# Altium project Ultrafit Breakout.PrjPcb
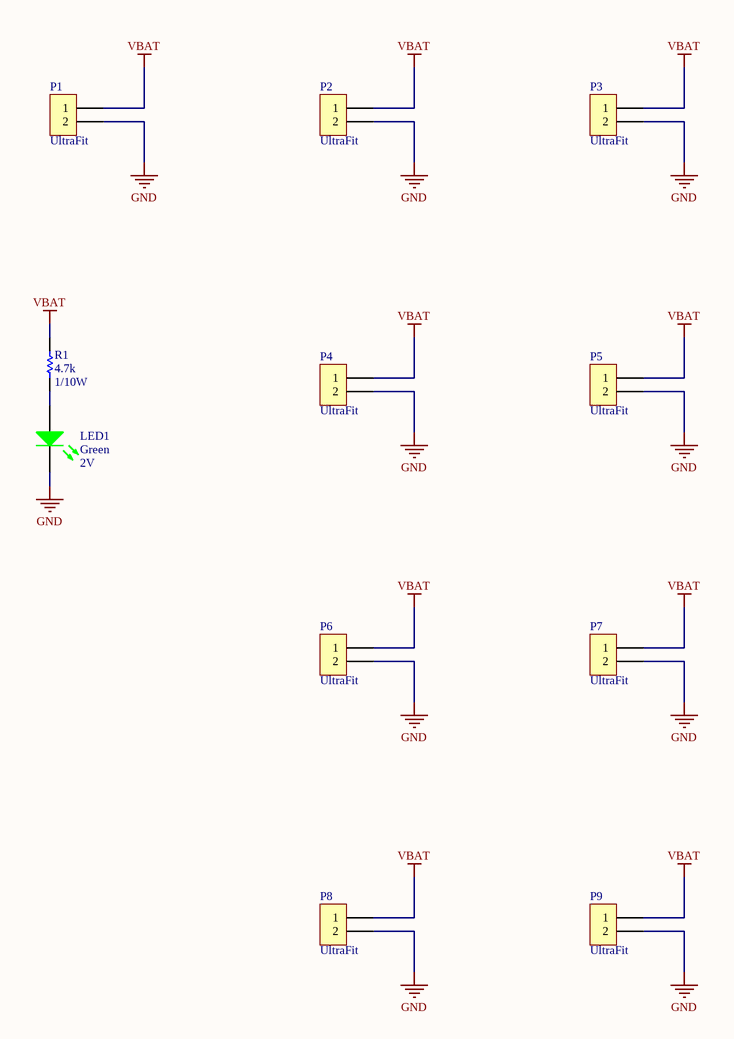
[diagram p0: Ultrafit Breakout.SchDoc]

1 sheet, 11 parts. Net scope: global (net labels, ports and power ports of the same name join across sheets).
Board file: Ultrafit Breakout.PcbDoc

## Sheet Ultrafit Breakout.SchDoc: Title
size B; Organization: Midnight Sun Solar Rayce Car Team; Address1: University of Waterloo; Address2: 200 University Ave W; Address3: Waterloo, ON, Canada; Address4: N2L 3E9; Website: www.uwmidsun.com; ProjectName: ProjectName

### Parts
LED1  Color: Green  Voltage - Forward (Vf) (Typ): 2V  [LED_0603]  (hidden comment: LED GREEN CLEAR 2V 0603)
P1  Series: UltraFit  [CONN, 2POS ULTRA-FIT]  (hidden comment: CONN 2POS ULTRA-FIT 0.138")
P2  Series: UltraFit  [CONN, 2POS ULTRA-FIT]  (hidden comment: CONN 2POS ULTRA-FIT 0.138")
P3  Series: UltraFit  [CONN, 2POS ULTRA-FIT]  (hidden comment: CONN 2POS ULTRA-FIT 0.138")
P4  Series: UltraFit  [CONN, 2POS ULTRA-FIT]  (hidden comment: CONN 2POS ULTRA-FIT 0.138")
P5  Series: UltraFit  [CONN, 2POS ULTRA-FIT]  (hidden comment: CONN 2POS ULTRA-FIT 0.138")
P6  Series: UltraFit  [CONN, 2POS ULTRA-FIT]  (hidden comment: CONN 2POS ULTRA-FIT 0.138")
P7  Series: UltraFit  [CONN, 2POS ULTRA-FIT]  (hidden comment: CONN 2POS ULTRA-FIT 0.138")
P8  Series: UltraFit  [CONN, 2POS ULTRA-FIT]  (hidden comment: CONN 2POS ULTRA-FIT 0.138")
P9  Series: UltraFit  [CONN, 2POS ULTRA-FIT]  (hidden comment: CONN 2POS ULTRA-FIT 0.138")
R1  Resistance (Ohms): 4.7k  Power (Watts): 1/10W  [RES, 0603]  (hidden comment: RES 4.7K OHM 1% 1/10W 0603)

### Nets
GND: LED1.2(K) P1.2 P2.2 P3.2 P4.2 P5.2 P6.2 P7.2 P8.2 P9.2
VBAT: P1.1 P2.1 P3.1 P4.1 P5.1 P6.1 P7.1 P8.1 P9.1 R1.1
NetLED1_1: LED1.1(A) R1.2

### Notes on the sheet
- PROJECT
- DOCUMENT
- DRAWN BY
- LAST MODIFIED
- PART NUMBER
- REVISION
- SHEET
- VARIANT
- OF
- Engineering 5 - 1002
  University of Waterloo
  (519) 888-4567 x32978
  hardware@uwmidsun.com

### Library data of the parts
LED1 = LED GREEN CLEAR 2V 0603: Green 572nm LED Indication - Discrete 2V 0603 (1608 Metric); Manufacturer: Wurth Electronics Inc.; Manufacturer Part Number: 150060VS75000; Lens Color: Colorless; Millicandela Rating: 40mcd; Lens Style/Size: Rectangle with Flat Top, 1.10mm x 0.70mm; Current - Test: 20mA; Viewing Angle: 140°; Wavelength - Dominant: 570nm; Supplier 1: Digi-Key; RoHS: RoHS Compliant; Category: Optoelectronics; Stock 1: 9408; Pricing 1: 1=0.21, 100=0.1617, 500=0.13964 (CAD); Packaging: Cut Tape (CT); Part Status: Active; Lens Transparency: Clear; Mounting Type: Surface Mount; Wavelength - Peak: 572nm; Features: -; Package / Case: 0603 (1608 Metric); Supplier Device Package: 0603; Size / Dimension: 1.60mm L x 0.80mm W; Height (Max): 0.80mm; ComponentLink1URL: http://katalog.we-online.de/led/datasheet/150060VS75000.pdf; ComponentLink1Description: http://katalog.we-online.de/led/datasheet/150060VS75000.pdf; Supplier Part Number 1: 732-4980-1-ND
P1-P9 = CONN 2POS ULTRA-FIT 0.138": 2 Positions Header, Shrouded Connector 0.138" (3.50mm) Through Hole Gold; Manufacturer 1: Molex, LLC; Manufacturer Part Number 1: 1722861302; Style: Board to Board or Cable; Shrouding: Shrouded - 4 Wall; Number of Positions: 2; Number of Positions Loaded: All; Contact Length - Post: 0.126" (3.20mm); Material Flammability Rating: UL94 V-0; Mated Stacking Heights: 26.99mm; Voltage: 400V; Supplier 1: Digi-Key; Supplier Part Number 1: WM11673-ND; Packaging: Tray; Part Status: Active; Connector Type: Header; Contact Type: Male Pin; Pitch - Mating: 0.138" (3.50mm); Number of Rows: 1; Row Spacing - Mating: -; Mounting Type: Through Hole; Termination: Kinked Pin, Solder; Fastening Type: Latch Holder; Contact Length - Mating: -; Overall Contact Length: -; Insulation Height: 0.465" (11.80mm); Contact Shape: Square; Contact Finish - Mating: Gold; Contact Finish Thickness - Mating: 30µin (0.76µm); Contact Finish - Post: Tin; Contact Material: Copper Alloy; Insulation Material: Liquid Crystal Polymer (LCP); Operating Temperature: -40°C ~ 120°C; Ingress Protection: -; Insulation Color: Black; Current Rating: -; Contact Finish Thickness - Post: 60µin (1.52µm); ComponentLink1URL: http://www.molex.com/pdm_docs/sd/1722861302_sd.pdf; ComponentLink1Description: http://www.molex.com/pdm_docs/sd/1722861302_sd.pdf
R1 = RES 4.7K OHM 1% 1/10W 0603: 4.7k Ohm ±1% 0.1W, 1/10W Chip Resistor 0603 (1608 Metric) Moisture Resistant Thick Film; Manufacturer 1: Yageo; Manufacturer Part Number 1: RC0603FR-074K7L; Description 1: RES SMD 4.7K OHM 1% 1/10W 0603; Temperature Coefficient: ±100ppm/°C; Supplier 1: Digi-Key; Supplier Part Number 1: 311-4.70KHRCT-ND; RoHS: RoHS Compliant; Category: Resistors; Stock 1: 3487566; Pricing 1: 1=0.16, 10=0.022, 100=0.0089, 1000=0.00402, 2500=0.00349 (CAD); Packaging: Cut Tape (CT); Part Status: Active; Composition: Thick Film; Features: Moisture Resistant; Operating Temperature: -55°C ~ 155°C; Package / Case: 0603 (1608 Metric); Supplier Device Package: 0603; Size / Dimension: 0.063" L x 0.031" W (1.60mm x 0.80mm); Height - Seated (Max): 0.022" (0.55mm); Failure Rate: -; ComponentLink1URL: http://www.yageo.com/documents/recent/PYu-RC_Group_51_RoHS_L_7.pdf; ComponentLink1Description: http://www.yageo.com/documents/recent/PYu-RC_Group_51_RoHS_L_7.pdf; Tolerance: ±1%